# Altium schematic sheet Sheet1.SchDoc
size 420 x 297 mm; Scale: None
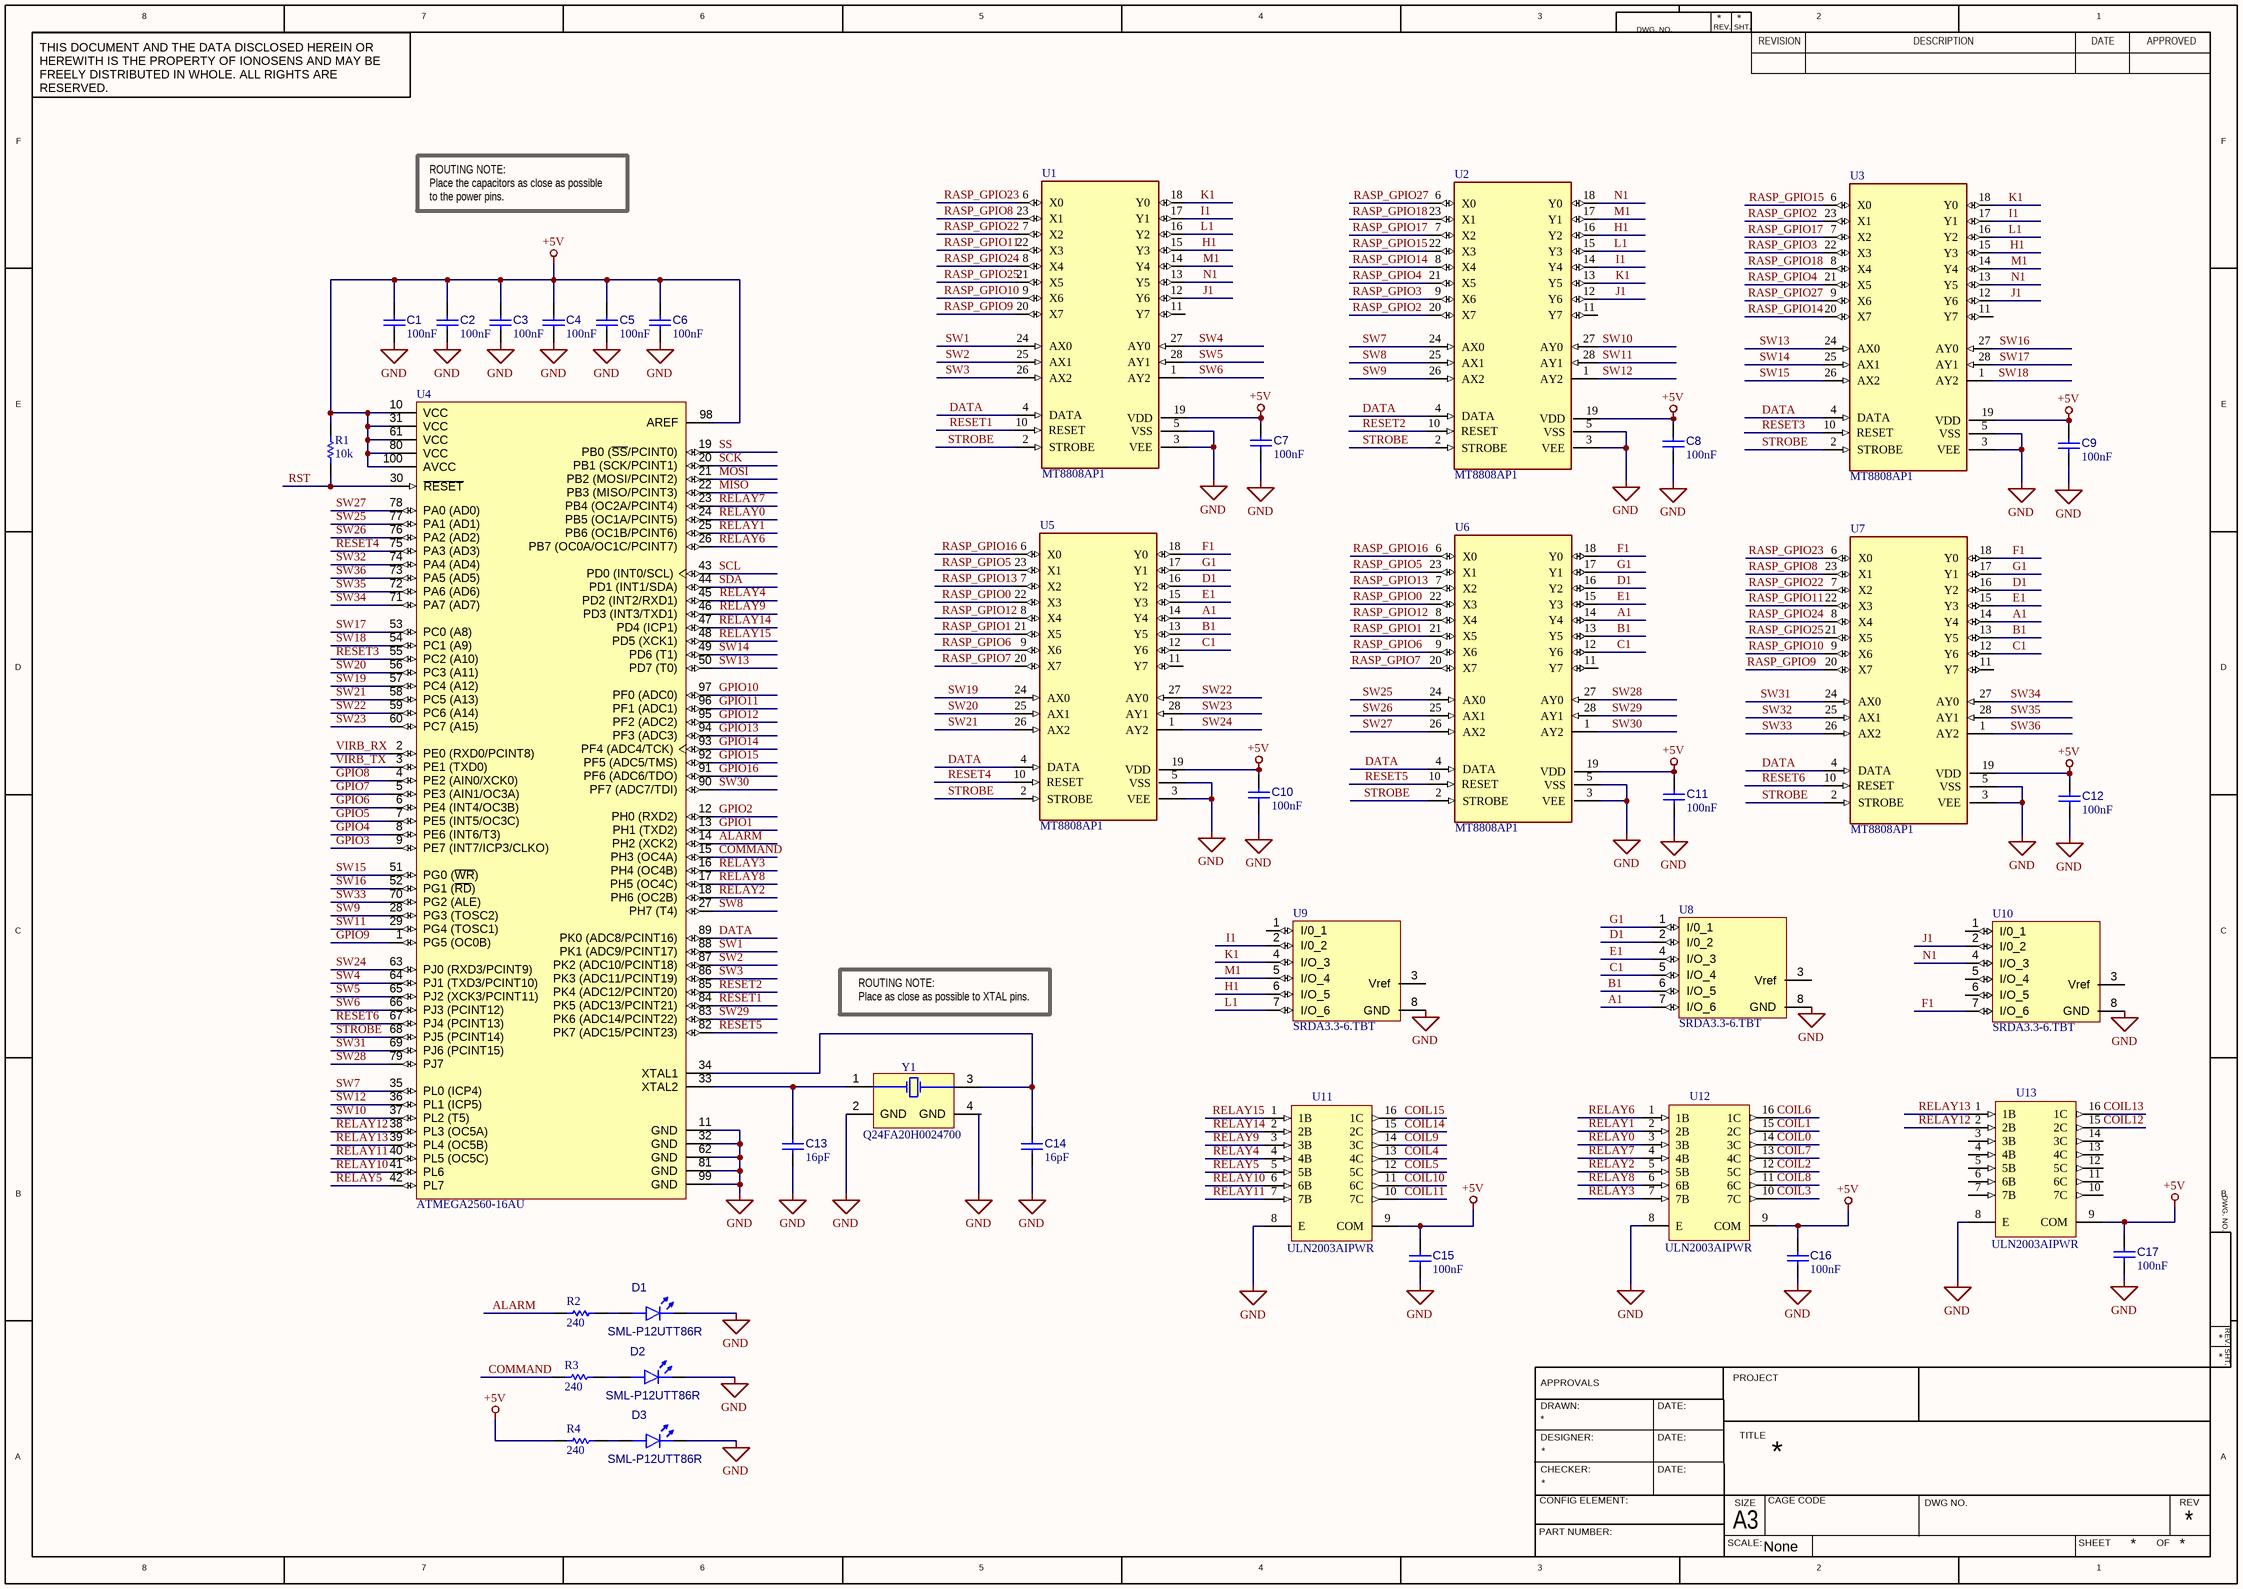
[diagram p0: Sheet1.SchDoc]

## Parts
C1  value 100nF  [CAPC1005X06M]  (hidden comment: CC0402JRX7R7BB104)
C2  value 100nF  [CAPC1005X06M]  (hidden comment: CC0402JRX7R7BB104)
C3  value 100nF  [CAPC1005X06M]  (hidden comment: CC0402JRX7R7BB104)
C4  value 100nF  [CAPC1005X06M]  (hidden comment: CC0402JRX7R7BB104)
C5  value 100nF  [CAPC1005X06M]  (hidden comment: CC0402JRX7R7BB104)
C6  value 100nF  [CAPC1005X06M]  (hidden comment: CC0402JRX7R7BB104)
C7  value 100nF  [CAPC1005X06M]  (hidden comment: CC0402JRX7R7BB104)
C8  value 100nF  [CAPC1005X06M]  (hidden comment: CC0402JRX7R7BB104)
C9  value 100nF  [CAPC1005X06M]  (hidden comment: CC0402JRX7R7BB104)
C10  value 100nF  [CAPC1005X06M]  (hidden comment: CC0402JRX7R7BB104)
C11  value 100nF  [CAPC1005X06M]  (hidden comment: CC0402JRX7R7BB104)
C12  value 100nF  [CAPC1005X06M]  (hidden comment: CC0402JRX7R7BB104)
C13  value 16pF  [CAPC1005X06M]  (hidden comment: CC0402JRNPO9BN160)
C14  value 16pF  [CAPC1005X06M]  (hidden comment: CC0402JRNPO9BN160)
C15  value 100nF  [CAPC1005X06M]  (hidden comment: CC0402JRX7R7BB104)
C16  value 100nF  [CAPC1005X06M]  (hidden comment: CC0402JRX7R7BB104)
C17  value 100nF  [CAPC1005X06M]  (hidden comment: CC0402JRX7R7BB104)
D1  SML-P12UTT86R  [DIOC1005X02R]
D2  SML-P12UTT86R  [DIOC1005X02R]
D3  SML-P12UTT86R  [DIOC1005X02R]
R1  value 10k  [RESC1005X04M]  (hidden comment: AC0402FR-0710KL)
R2  value 240  [RESC1005X04M]  (hidden comment: AC0402FR-07240RL)
R3  value 240  [RESC1005X04M]  (hidden comment: AC0402FR-07240RL)
R4  value 240  [RESC1005X04M]  (hidden comment: AC0402FR-07240RL)
U1  MT8808AP1  [PLCC127P1244X1244X457-28M]
U2  MT8808AP1  [PLCC127P1244X1244X457-28M]
U3  MT8808AP1  [PLCC127P1244X1244X457-28M]
U4  ATMEGA2560-16AU  [ATML-100A_M]
U5  MT8808AP1  [PLCC127P1244X1244X457-28M]
U6  MT8808AP1  [PLCC127P1244X1244X457-28M]
U7  MT8808AP1  [PLCC127P1244X1244X457-28M]
U8  SRDA3.3-6.TBT  [SOIC127P600X175-8M]
U9  SRDA3.3-6.TBT  [SOIC127P600X175-8M]
U10  SRDA3.3-6.TBT  [SOIC127P600X175-8M]
U11  ULN2003AIPWR  [TSOP65P640X120-16M]
U12  ULN2003AIPWR  [TSOP65P640X120-16M]
U13  ULN2003AIPWR  [TSOP65P640X120-16M]
Y1  Q24FA20H0024700  [FA-20H]

## Nets
+5V: C1.2 C2.2 C3.2 C4.2 C5.2 C6.2 C7.2 C8.2 C9.2 C10.2 C11.2 C12.2 C15.2 C16.2 C17.2 R1.2 R4.1 U1.19(VDD) U2.19(VDD) U3.19(VDD) U4.10(VCC) U4.31(VCC) U4.61(VCC) U4.80(VCC) U4.98(AREF) U4.100(AVCC) U5.19(VDD) U6.19(VDD) U7.19(VDD) U11.9(COM) U12.9(COM) U13.9(COM)
GND: C1.1 C2.1 C3.1 C4.1 C5.1 C6.1 C7.1 C8.1 C9.1 C10.1 C11.1 C12.1 C13.1 C14.1 C15.1 C16.1 C17.1 D1.1(K) D2.1(K) D3.1(K) U1.3(VEE) U1.5(VSS) U2.3(VEE) U2.5(VSS) U3.3(VEE) U3.5(VSS) U4.11(GND) U4.32(GND) U4.62(GND) U4.81(GND) U4.99(GND) U5.3(VEE) U5.5(VSS) U6.3(VEE) U6.5(VSS) U7.3(VEE) U7.5(VSS) U8.8(GND) U9.8(GND) U10.8(GND) U11.8(E) U12.8(E) U13.8(E) Y1.2(GND) Y1.4(GND)
A1: U5.14(Y4) U6.14(Y4) U7.14(Y4) U8.7(I/O_6)
ALARM: R2.1 U4.14(PH2_(XCK2))
B1: U5.13(Y5) U6.13(Y5) U7.13(Y5) U8.6(I/O_5)
C1: U5.12(Y6) U6.12(Y6) U7.12(Y6) U8.5(I/O_4)
COIL0: U12.14(3C)
COIL1: U12.15(2C)
COIL2: U12.12(5C)
COIL3: U12.10(7C)
COIL4: U11.13(4C)
COIL5: U11.12(5C)
COIL6: U12.16(1C)
COIL7: U12.13(4C)
COIL8: U12.11(6C)
COIL9: U11.14(3C)
COIL10: U11.11(6C)
COIL11: U11.10(7C)
COIL12: U13.15(2C)
COIL13: U13.16(1C)
COIL14: U11.15(2C)
COIL15: U11.16(1C)
COMMAND: R3.1 U4.15(PH3_(OC4A))
D1: U5.16(Y2) U6.16(Y2) U7.16(Y2) U8.2(I/0_2)
DATA: U1.4(DATA) U2.4(DATA) U3.4(DATA) U4.89(PK0_(ADC8/PCINT16)) U5.4(DATA) U6.4(DATA) U7.4(DATA)
E1: U5.15(Y3) U6.15(Y3) U7.15(Y3) U8.4(I/O_3)
F1: U5.18(Y0) U6.18(Y0) U7.18(Y0) U10.7(I/O_6)
G1: U5.17(Y1) U6.17(Y1) U7.17(Y1) U8.1(I/0_1)
GPIO1: U4.13(PH1_(TXD2))
GPIO2: U4.12(PH0_(RXD2))
GPIO3: U4.9(PE7_(INT7/ICP3/CLKO))
GPIO4: U4.8(PE6_(INT6/T3))
GPIO5: U4.7(PE5_(INT5/OC3C))
GPIO6: U4.6(PE4_(INT4/OC3B))
GPIO7: U4.5(PE3_(AIN1/OC3A))
GPIO8: U4.4(PE2_(AIN0/XCK0))
GPIO9: U4.1(PG5_(OC0B))
GPIO10: U4.97(PF0_(ADC0))
GPIO11: U4.96(PF1_(ADC1))
GPIO12: U4.95(PF2_(ADC2))
GPIO13: U4.94(PF3_(ADC3))
GPIO14: U4.93(PF4_(ADC4/TCK))
GPIO15: U4.92(PF5_(ADC5/TMS))
GPIO16: U4.91(PF6_(ADC6/TDO))
H1: U1.15(Y3) U2.16(Y2) U3.15(Y3) U9.6(I/O_5)
I1: U1.17(Y1) U2.14(Y4) U3.17(Y1) U9.2(I/0_2)
J1: U1.12(Y6) U2.12(Y6) U3.12(Y6) U10.2(I/0_2)
K1: U1.18(Y0) U2.13(Y5) U3.18(Y0) U9.4(I/O_3)
L1: U1.16(Y2) U2.15(Y3) U3.16(Y2) U9.7(I/O_6)
M1: U1.14(Y4) U2.17(Y1) U3.14(Y4) U9.5(I/O_4)
MISO: U4.22(PB3_(MISO/PCINT3))
MOSI: U4.21(PB2_(MOSI/PCINT2))
N1: U1.13(Y5) U2.18(Y0) U3.13(Y5) U10.4(I/O_3)
RASP_GPIO0: U5.22(X3) U6.22(X3)
RASP_GPIO1: U5.21(X5) U6.21(X5)
RASP_GPIO2: U2.20(X7) U3.23(X1)
RASP_GPIO3: U2.9(X6) U3.22(X3)
RASP_GPIO4: U2.21(X5) U3.21(X5)
RASP_GPIO5: U5.23(X1) U6.23(X1)
RASP_GPIO6: U5.9(X6) U6.9(X6)
RASP_GPIO7: U5.20(X7) U6.20(X7)
RASP_GPIO8: U1.23(X1) U7.23(X1)
RASP_GPIO9: U1.20(X7) U7.20(X7)
RASP_GPIO10: U1.9(X6) U7.9(X6)
RASP_GPIO11: U1.22(X3) U7.22(X3)
RASP_GPIO12: U5.8(X4) U6.8(X4)
RASP_GPIO13: U5.7(X2) U6.7(X2)
RASP_GPIO14: U2.8(X4) U3.20(X7)
RASP_GPIO15: U2.22(X3) U3.6(X0)
RASP_GPIO16: U5.6(X0) U6.6(X0)
RASP_GPIO17: U2.7(X2) U3.7(X2)
RASP_GPIO18: U2.23(X1) U3.8(X4)
RASP_GPIO22: U1.7(X2) U7.7(X2)
RASP_GPIO23: U1.6(X0) U7.6(X0)
RASP_GPIO24: U1.8(X4) U7.8(X4)
RASP_GPIO25: U1.21(X5) U7.21(X5)
RASP_GPIO27: U2.6(X0) U3.9(X6)
RELAY0: U4.24(PB5_(OC1A/PCINT5)) U12.3(3B)
RELAY1: U4.25(PB6_(OC1B/PCINT6)) U12.2(2B)
RELAY2: U4.18(PH6_(OC2B)) U12.5(5B)
RELAY3: U4.16(PH4_(OC4B)) U12.7(7B)
RELAY4: U4.45(PD2_(INT2/RXD1)) U11.4(4B)
RELAY5: U4.42(PL7) U11.5(5B)
RELAY6: U4.26(PB7_(OC0A/OC1C/PCINT7)) U12.1(1B)
RELAY7: U4.23(PB4_(OC2A/PCINT4)) U12.4(4B)
RELAY8: U4.17(PH5_(OC4C)) U12.6(6B)
RELAY9: U4.46(PD3_(INT3/TXD1)) U11.3(3B)
RELAY10: U4.41(PL6) U11.6(6B)
RELAY11: U4.40(PL5_(OC5C)) U11.7(7B)
RELAY12: U4.38(PL3_(OC5A)) U13.2(2B)
RELAY13: U4.39(PL4_(OC5B)) U13.1(1B)
RELAY14: U4.47(PD4_(ICP1)) U11.2(2B)
RELAY15: U4.48(PD5_(XCK1)) U11.1(1B)
RESET1: U1.10(RESET) U4.84(PK5_(ADC13/PCINT21))
RESET2: U2.10(RESET) U4.85(PK4_(ADC12/PCINT20))
RESET3: U3.10(RESET) U4.55(PC2_(A10))
RESET4: U4.75(PA3_(AD3)) U5.10(RESET)
RESET5: U4.82(PK7_(ADC15/PCINT23)) U6.10(RESET)
RESET6: U4.67(PJ4_(PCINT13)) U7.10(RESET)
RST: R1.1 U4.30(~{RESET})
SCK: U4.20(PB1_(SCK/PCINT1))
SCL: U4.43(PD0_(INT0/SCL))
SDA: U4.44(PD1_(INT1/SDA))
SS: U4.19(PB0_(~{SS}/PCINT0))
STROBE: U1.2(STROBE) U2.2(STROBE) U3.2(STROBE) U4.68(PJ5_(PCINT14)) U5.2(STROBE) U6.2(STROBE) U7.2(STROBE)
SW1: U1.24(AX0) U4.88(PK1_(ADC9/PCINT17))
SW2: U1.25(AX1) U4.87(PK2_(ADC10/PCINT18))
SW3: U1.26(AX2) U4.86(PK3_(ADC11/PCINT19))
SW4: U1.27(AY0) U4.64(PJ1_(TXD3/PCINT10))
SW5: U1.28(AY1) U4.65(PJ2_(XCK3/PCINT11))
SW6: U1.1(AY2) U4.66(PJ3_(PCINT12))
SW7: U2.24(AX0) U4.35(PL0_(ICP4))
SW8: U2.25(AX1) U4.27(PH7_(T4))
SW9: U2.26(AX2) U4.28(PG3_(TOSC2))
SW10: U2.27(AY0) U4.37(PL2_(T5))
SW11: U2.28(AY1) U4.29(PG4_(TOSC1))
SW12: U2.1(AY2) U4.36(PL1_(ICP5))
SW13: U3.24(AX0) U4.50(PD7_(T0))
SW14: U3.25(AX1) U4.49(PD6_(T1))
SW15: U3.26(AX2) U4.51(PG0_(~{WR}))
SW16: U3.27(AY0) U4.52(PG1_(~{RD}))
SW17: U3.28(AY1) U4.53(PC0_(A8))
SW18: U3.1(AY2) U4.54(PC1_(A9))
SW19: U4.57(PC4_(A12)) U5.24(AX0)
SW20: U4.56(PC3_(A11)) U5.25(AX1)
SW21: U4.58(PC5_(A13)) U5.26(AX2)
SW22: U4.59(PC6_(A14)) U5.27(AY0)
SW23: U4.60(PC7_(A15)) U5.28(AY1)
SW24: U4.63(PJ0_(RXD3/PCINT9)) U5.1(AY2)
SW25: U4.77(PA1_(AD1)) U6.24(AX0)
SW26: U4.76(PA2_(AD2)) U6.25(AX1)
SW27: U4.78(PA0_(AD0)) U6.26(AX2)
SW28: U4.79(PJ7) U6.27(AY0)
SW29: U4.83(PK6_(ADC14/PCINT22)) U6.28(AY1)
SW30: U4.90(PF7_(ADC7/TDI)) U6.1(AY2)
SW31: U4.69(PJ6_(PCINT15)) U7.24(AX0)
SW32: U4.74(PA4_(AD4)) U7.25(AX1)
SW33: U4.70(PG2_(ALE)) U7.26(AX2)
SW34: U4.71(PA7_(AD7)) U7.27(AY0)
SW35: U4.72(PA6_(AD6)) U7.28(AY1)
SW36: U4.73(PA5_(AD5)) U7.1(AY2)
VIRB_RX: U4.2(PE0_(RXD0/PCINT8))
VIRB_TX: U4.3(PE1_(TXD0))
NetC13_2: C13.2 U4.33(XTAL2) Y1.1(X1)
NetC14_2: C14.2 U4.34(XTAL1) Y1.3(X2)
NetD1_2: D1.2(A) R2.2
NetD2_2: D2.2(A) R3.2
NetD3_2: D3.2(A) R4.2

Not connected (* = marked no-connect by the designer): U1 11(Y7); U2 11(Y7); U3 11(Y7); U5 11(Y7); U6 11(Y7); U7 11(Y7); U8 3(Vref); U9 1(I/0_1) 3(Vref); U10 1(I/0_1) 3(Vref) 5(I/O_4) 6(I/O_5); U13 3(3B) 4(4B) 5(5B) 6(6B) 7(7B) 10(7C) 11(6C) 12(5C) 13(4C) 14(3C)

## Notes on the sheet
- ROUTING NOTE:
  Place the capacitors as close as possible to the power pins.
- ROUTING NOTE:
  Place as close as possible to XTAL pins.
- 8
- 7
- 6
- 5
- 4
- 3
- DWG. NO.
- REV.
- SHT.
- REVISION
- 2
- DESCRIPTION
- DATE
- 1
- APPROVED
- THIS DOCUMENT AND THE DATA DISCLOSED HEREIN OR HEREWITH IS THE PROPERTY OF IONOSENS AND MAY BE FREELY DISTRIBUTED IN WHOLE. ALL RIGHTS ARE RESERVED.
- F
- E
- D
- C
- B
- DRAWN:
- APPROVALS
- DATE:
- PROJECT
- A
- CHECKER:
- DESIGNER:
- TITLE
- PART NUMBER:
- CONFIG ELEMENT:
- SCALE:
- A3
- SIZE
- CAGE CODE
- DWG NO.
- SHEET
- OF
- REV

## Library data of the parts
C1-C12 C15-C17 = C01-0402-01-00001-1: Cap Ceramic 100nF 50V X7R 5% SMD 0402 125°C; Manufacturer: YAGEO; Voltage Rating: 16V; Case/Package: 0402; Capacitor Type: Ceramic; Min Operating Temperature: -55°C; Width: 508µm; Length: 1mm; Tolerance: 5%; Dielectric: X7R; RoHS Compliant: Yes; Pins: 2; Composition: Ceramic; Depth: 500µm; Voltage Rating (DC): 16V; Mount: Surface Mount; Mounting Technology: Surface Mount; Termination: SMD/SMT; Manufacturer P/N: CC0402JRX7R7BB104; Thickness: 558.8µm; Max Operating Temperature: 125°C
C13 C14 = C01-0402-01-00000-2: Cap Ceramic 16pF 50V C0G 5% SMD 0402 125°C; Manufacturer: YAGEO; Dielectric: COG; Depth: 500µm; Mount: Surface Mount; Voltage Rating (DC): 50V; Width: 508µm; Pins: 2; Manufacturer P/N: CC0402JRNPO9BN160; Length: 990.6µm; Composition: Ceramic; Thickness: 558.8µm; Mounting Technology: Surface Mount; RoHS Compliant: Yes; Voltage Rating: 50V; Termination: SMD/SMT; Tolerance: 5%; Capacitor Type: Ceramic; Min Operating Temperature: -55°C; Max Operating Temperature: 125°C; Case/Package: 0402
D1-D3 = D01-0402-01-00001-1: Led red 0402; Manufacturer: ROHM; Number of LEDs: 1; Max Power Dissipation: 52mW; Luminous Intensity: 85 mcd; Dominant Wavelength: 620 nm; Lens Style: Rectangular, Square; Forward Current: 20 mA; Forward Voltage: 2V; Mounting Technology: SMD; Case/Package: 0402; Min Operating Temperature: -40°C; Max Operating Temperature: 85°C; Manufacturer P/N: SML-P12UTT86R; Colour: red; RoHS Compliant: Yes; Pins: 2
R1 = R01-0402-01-00169-2: RES SMD 10K OHM 1% 1/16W 0402; Manufacturer: Yageo; Temperature Coefficient: 100 ppm/ºC; Power Rating: 62.5mW; Voltage Rating: 50V; Length: 990.6µm; Height: 370µm; Min Operating Temperature: -55°C; Case/Package: 0402; Features: Automotive AEC-Q200, Moisture Resistant; Packaging: Tape & Reel; Width: 508µm; Manufacturer P/N: AC0402FR-0710KL; RoHS: Yes; Max Operating Temperature: 155°C; Tolerance: 1%; Composition: Thick Film; Number of Terminations: 2
R2-R4 = R01-0402-01-00437-2: RES SMD 240 OHM 1% 1/16W 0402; Manufacturer: Yageo; Temperature Coefficient: 100 ppm/ºC; Power Rating: 62.5mW; Voltage Rating: 50V; Packaging: Tape & Reel; Manufacturer P/N: AC0402FR-07240RL; Height: 370µm; Case/Package: 0402; Composition: Thick Film; Max Operating Temperature: 155°C; Number of Terminations: 2; RoHS: Yes; Min Operating Temperature: -55°C; Tolerance: 1%; Width: 508µm; Length: 990.6µm; Features: Automotive AEC-Q200, Moisture Resistant
U1-U3 U5-U7 = CMP-0007-0001-00001-1: 8 x 8 Analog Switch Array with Low On-resistance, for (VDD - VEE) = 4.5 to 13.2V; Manufacturer: Microchip; Number of Inputs: 8; Max Supply Voltage: 85V; On-State Resistance: 65; Min Supply Voltage: 4.5; Output Current: 15mA; Number of Outputs: 8; Length: 11.58mm; Manufacturer P/N: MT8808AP1; Mounting Technology: SMD; Pins: 28; Max Operating Temperature: 13.2°C; Number of Elements: 8; Min Operating Temperature: -40°C; Width: 11.58mm; Height: 4.57mm; RoHS Compliant: yes; Case/Package: PLLC
U4 = U01-0007-01-00000-1: AVR ATmega Microcontroller 8-bit 16MHz 256KB FLASH TQFP100; Manufacturer: Microchip; Oscillator Type: External; Interface: I2C, SPI, UART; Minimum Supply Voltage: 4.5V; Peripherals: Brown-out Detect/Reset, POR, PWM, WDT; Number of A/D: 1 AD / 16 channels; Watchdog Timer: Yes; Number of I/O: 86; RAM Size: 8KB; Max Supply Voltage: 5.5V; Max Operating Temperature: 85°C; Manufacturer P/N: ATMEGA2560-16AU; Memory Size: 256KB; Mounting Technology: SMD; Memory Type: FLASH; Pins: 100; Height: 1.2mm; Case/Package: A; RoHS: Yes; Min Operating Temperature: -40°C; Max Frequency: 16MHz; Number of Programmable I/O: 86; Contact Plating: Tin; Core Architecture: AVR; Frequency: 16MHz; Width: 16.25mm
U8-U10 = CMP-0005-0001-00000-1: SRDA Series 15 V 8 pF SMT RailClamp® Low Capacitance TVS Diode Array - SOIC-8; Manufacturer: Semtech; Number of Channels: 6; Peak Pulse Current: 25A; Max Breakdown Voltage: 6V; Max Power Dissipation: 500W; Direction: Unidirectional; Clamping Voltage: 15V; Capacitance: 8pF; Breakdown Voltage: 3.2V; Leakage Current: 1µV; Manufacturer P/N: SRDA3.3-6.TBT; Height: 1.75mm; Case/Package: so-8; Pins: 8; Length: 5mm; Min Operating Temperature: -55°C; Mounting Technology: SMD; Max Operating Temperature: 125°C; RoHS Compliant: yes; Width: 4mm
U11-U13 = CMP-0005-0001-00001-1: 50-V, 7-ch darlington transistor array, -40 to 105C 16-TSSOP -40 to 105; Manufacturer: Texas Instruments; Voltage Rating: 50V; Min Operating Temperature: 105°C; RoHS Compliant: yes; Pins: 16; Case/Package: TSSOP; Mounting Technology: SMD; Length: 5mm; Manufacturer P/N: ULN2003AIPWR; Height: 1.2mm; Max Operating Temperature: -40°C; Width: 4.4mm
Y1 = Y01-0001-01-00000-11: 16MHz ±10ppm 16pF 80Ω SMD-2520_4P; Manufacturer: SEIKO-EPSON; ESR: 80; RoHS Compliant: yes; Min Operating Temperature: -40°C; Load Capacitance: 16pF; Mounting Technology: SMD; Pins: 4; Case/Package: SMD-2520_4P; Max Operating Temperature: 85°C; Frequency: 16MHz; Manufacturer P/N: Q24FA20H0024700